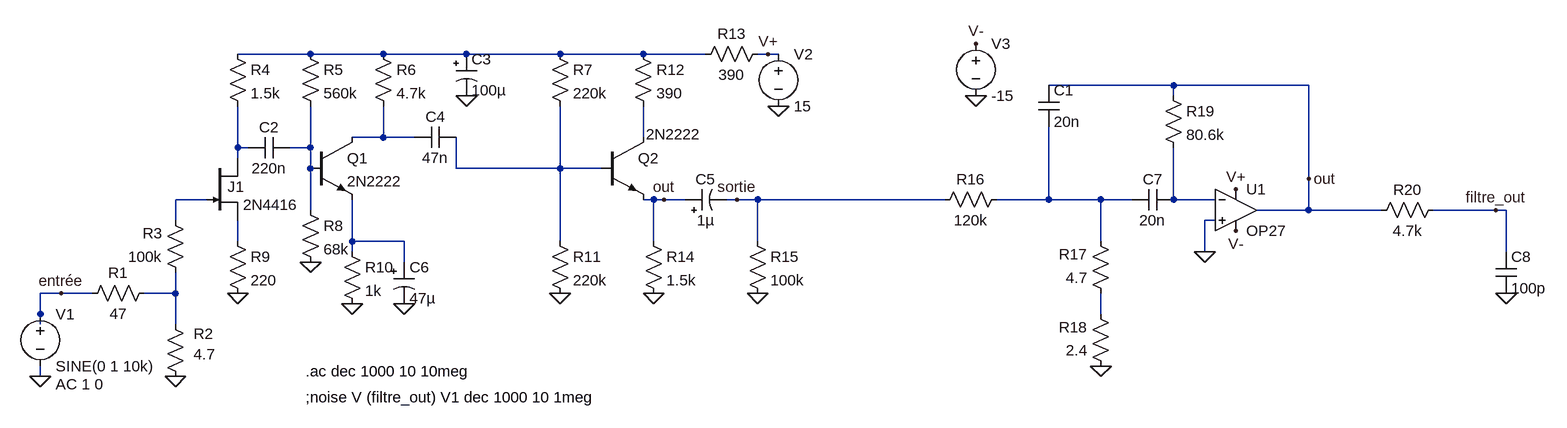
[diagram p0: schematic montage_tp3.asc]
montage_tp3.asc, the LTspice schematic file:
Version 4
SHEET 1 2264 680
WIRE 352 -208 240 -208
WIRE 464 -208 352 -208
WIRE 592 -208 464 -208
WIRE 736 -208 592 -208
WIRE 864 -208 736 -208
WIRE 960 -208 864 -208
WIRE 1056 -208 1040 -208
WIRE 1072 -208 1056 -208
WIRE 1680 -160 1488 -160
WIRE 1888 -160 1680 -160
WIRE 1680 -144 1680 -160
WIRE 464 -80 464 -128
WIRE 464 -80 416 -80
WIRE 512 -80 464 -80
WIRE 864 -80 864 -128
WIRE 240 -64 240 -128
WIRE 256 -64 240 -64
WIRE 352 -64 352 -128
WIRE 352 -64 320 -64
WIRE 240 -48 240 -64
WIRE 352 -32 352 -64
WIRE 576 -32 576 -80
WIRE 736 -32 736 -128
WIRE 736 -32 576 -32
WIRE 800 -32 736 -32
WIRE 1888 -16 1888 -160
WIRE 192 16 144 16
WIRE 880 16 864 16
WIRE 896 16 880 16
WIRE 928 16 896 16
WIRE 1008 16 992 16
WIRE 1040 16 1008 16
WIRE 1328 16 1040 16
WIRE 1488 16 1488 -96
WIRE 1488 16 1408 16
WIRE 1568 16 1488 16
WIRE 1616 16 1568 16
WIRE 1680 16 1680 -64
WIRE 1744 16 1680 16
WIRE 352 32 352 -32
WIRE 1888 32 1888 -16
WIRE 1888 32 1808 32
WIRE 2000 32 1888 32
WIRE 2176 32 2080 32
WIRE 2192 32 2176 32
WIRE 144 48 144 16
WIRE 1744 48 1728 48
WIRE 240 80 240 48
WIRE 416 80 416 16
WIRE 496 80 416 80
WIRE 736 80 736 -32
WIRE 880 80 880 16
WIRE 1040 80 1040 16
WIRE 1568 80 1568 16
WIRE 416 96 416 80
WIRE 1728 96 1728 48
WIRE 2192 96 2192 32
WIRE 496 112 496 80
WIRE -32 160 -64 160
WIRE 16 160 -32 160
WIRE 144 160 144 128
WIRE 144 160 96 160
WIRE -64 192 -64 160
WIRE 1568 192 1568 160
WIRE -64 208 -64 192
WIRE 144 208 144 160
WIRE -64 288 -64 272
FLAG -64 288 0
FLAG 144 288 0
FLAG 592 -144 0
FLAG 240 160 0
FLAG 352 112 0
FLAG 416 176 0
FLAG 496 176 0
FLAG 736 160 0
FLAG 1072 -128 0
FLAG 880 160 0
FLAG 1040 160 0
FLAG -32 160 entrée
FLAG 896 16 out
FLAG 1008 16 sortie
FLAG 1568 272 0
FLAG 1728 96 0
FLAG 2192 160 0
FLAG 2176 32 filtre_out
FLAG 1888 -16 out
FLAG 1376 -144 0
FLAG 1056 -208 V+
FLAG 1376 -224 V-
FLAG 1776 0 V+
FLAG 1776 64 V-
SYMBOL voltage -64 176 R0
WINDOW 123 24 124 Left 2
WINDOW 39 0 0 Left 0
SYMATTR InstName V1
SYMATTR Value SINE(0 1 10k)
SYMATTR Value2 AC 1 0
SYMBOL res 112 144 R90
WINDOW 0 0 56 VBottom 2
WINDOW 3 32 56 VTop 2
SYMATTR InstName R1
SYMATTR Value 47
SYMBOL res 160 304 R180
WINDOW 0 -43 82 Left 2
WINDOW 3 -46 50 Left 2
SYMATTR InstName R2
SYMATTR Value 4.7
SYMBOL res 160 144 R180
WINDOW 0 36 76 Left 2
WINDOW 3 36 40 Left 2
SYMATTR InstName R3
SYMATTR Value 100k
SYMBOL res 224 -224 R0
SYMATTR InstName R4
SYMATTR Value 1.5k
SYMBOL res 336 -224 R0
SYMATTR InstName R5
SYMATTR Value 560k
SYMBOL res 448 -224 R0
SYMATTR InstName R6
SYMATTR Value 4.7k
SYMBOL res 720 -224 R0
SYMATTR InstName R7
SYMATTR Value 220k
SYMBOL res 336 16 R0
SYMATTR InstName R8
SYMATTR Value 68k
SYMBOL cap 320 -80 R90
WINDOW 0 0 32 VBottom 2
WINDOW 3 32 32 VTop 2
SYMATTR InstName C2
SYMATTR Value 220n
SYMBOL njf 192 -48 R0
WINDOW 0 32 44 Left 2
SYMATTR InstName J1
SYMATTR Value 2N4416
SYMBOL res 224 64 R0
SYMATTR InstName R9
SYMATTR Value 220
SYMBOL npn 352 -80 R0
SYMATTR InstName Q1
SYMATTR Value 2N2222
SYMBOL res 400 80 R0
SYMATTR InstName R10
SYMATTR Value 1k
SYMBOL cap 576 -96 R90
WINDOW 0 0 32 VBottom 2
WINDOW 3 32 32 VTop 2
SYMATTR InstName C4
SYMATTR Value 47n
SYMBOL npn 800 -80 R0
WINDOW 3 68 -5 Left 2
SYMATTR InstName Q2
SYMATTR Value 2N2222
SYMBOL res 720 64 R0
SYMATTR InstName R11
SYMATTR Value 220k
SYMBOL res 848 -224 R0
SYMATTR InstName R12
SYMATTR Value 390
SYMBOL res 1056 -224 R90
WINDOW 0 0 56 VBottom 2
WINDOW 3 32 56 VTop 2
SYMATTR InstName R13
SYMATTR Value 390
SYMBOL voltage 1072 -224 R0
SYMATTR InstName V2
SYMATTR Value 15
SYMBOL res 864 64 R0
SYMATTR InstName R14
SYMATTR Value 1.5k
SYMBOL res 1024 64 R0
SYMATTR InstName R15
SYMATTR Value 100k
SYMBOL polcap 576 -208 R0
SYMATTR InstName C3
SYMATTR Value 100µ
SYMBOL polcap 928 32 R270
WINDOW 0 32 32 VTop 2
WINDOW 3 0 32 VBottom 2
SYMATTR InstName C5
SYMATTR Value 1µ
SYMBOL polcap 480 112 R0
SYMATTR InstName C6
SYMATTR Value 47µ
SYMBOL res 1424 0 R90
WINDOW 0 0 56 VBottom 2
WINDOW 3 32 56 VTop 2
SYMATTR InstName R16
SYMATTR Value 120k
SYMBOL res 1584 176 R180
WINDOW 0 36 76 Left 2
WINDOW 3 36 40 Left 2
SYMATTR InstName R17
SYMATTR Value 4.7
SYMBOL res 1584 288 R180
WINDOW 0 36 76 Left 2
WINDOW 3 36 40 Left 2
SYMATTR InstName R18
SYMATTR Value 2.4
SYMBOL cap 1472 -160 R0
SYMATTR InstName C1
SYMATTR Value 20n
SYMBOL cap 1616 32 R270
WINDOW 0 32 32 VTop 2
WINDOW 3 0 32 VBottom 2
SYMATTR InstName C7
SYMATTR Value 20n
SYMBOL res 1664 -160 R0
SYMATTR InstName R19
SYMATTR Value 80.6k
SYMBOL OpAmps\\OP27 1776 -32 R0
SYMATTR InstName U1
SYMBOL res 2096 16 R90
WINDOW 0 0 56 VBottom 2
WINDOW 3 32 56 VTop 2
SYMATTR InstName R20
SYMATTR Value 4.7k
SYMBOL cap 2176 96 R0
SYMATTR InstName C8
SYMATTR Value 100p
SYMBOL voltage 1376 -240 R0
WINDOW 123 0 0 Left 0
WINDOW 39 0 0 Left 0
SYMATTR InstName V3
SYMATTR Value -15
TEXT 344 280 Left 2 !.ac dec 1000 10 10meg
TEXT 344 320 Left 2 !;noise V (filtre_out) V1 dec 1000 10 1meg

The netlist it stands for:
* montage_tp3.asc
V1 entrée 0 SINE(0 1 10k) AC 1 0
R1 N012 entrée 47
R2 0 N012 4.7
R3 N012 N007 100k
R4 N001 N004 1.5k
R5 N001 N005 560k
R6 N001 N002 4.7k
R7 N001 N006 220k
R8 N005 0 68k
C2 N005 N004 220n
J1 N004 N007 N010 2N4416
R9 N010 0 220
Q1 N002 N005 N011 0 2N2222
R10 N011 0 1k
C4 N006 N002 47n
Q2 N003 N006 out 0 2N2222
R11 N006 0 220k
R12 N001 N003 390
R13 V+ N001 390
V2 V+ 0 15
R14 out 0 1.5k
R15 sortie 0 100k
C3 N001 0 100µ
C5 out sortie 1µ
C6 N011 0 47µ
R16 N008 sortie 120k
R17 N013 N008 4.7
R18 0 N013 2.4
C1 out N008 20n
C7 N008 N009 20n
R19 out N009 80.6k
XU1 0 N009 V+ V- out OP27  ; pins In+ In- V+ V- OUT
R20 filtre_out out 4.7k
C8 filtre_out 0 100p
V3 V- 0 -15
.model NPN NPN
.model PNP PNP
.lib standard.bjt
.model NJF NJF
.model PJF PJF
.lib standard.jft
.ac dec 1000 10 10meg
;noise V (filtre_out) V1 dec 1000 10 1meg
.lib ADI.lib
.backanno
.end